# Altium schematic sheet Power_Supply_Current_Transformers.SchDoc
size A4; CompanyName: Technische Hochschule Nürnberg Georg Simon Ohm; Organization: UltraZohm; Address1: Kesslerplatz 12; Address2: 90489 Nürnberg; Address3: GERMANY; SheetNumber: 6; SheetTotal: 6; Website: www.ultrazohm.com
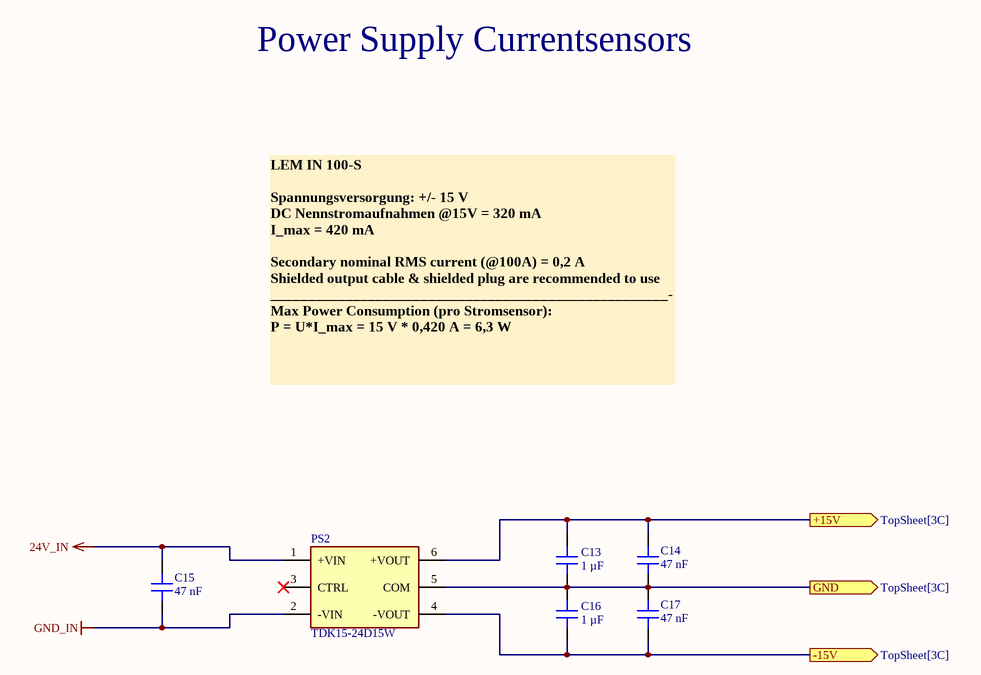
[diagram p0: Power_Supply_Current_Transformers.SchDoc]

## Parts
C13  1 µF  [C_0603]
C14  47 nF  [C_0603]
C15  47 nF  [C_0603]
C16  1 µF  [C_0603]
C17  47 nF  [C_0603]
PS2  TDK15-24D15W  [TDK15-24D15W]

## Ports
+15V (out, see TopSheet[3C]), -15V (out, see TopSheet[3C]), GND (out, see TopSheet[3C])

## Nets
24V_IN: C15.2 PS2.1(+VIN)
GND_IN: C15.1 PS2.2(-VIN)
+15V: C13.2 C14.2 PS2.6(+VOUT) ; port +15V
-15V: C16.1 C17.1 PS2.4(-VOUT) ; port -15V
GND: C13.1 C14.1 C16.2 C17.2 PS2.5(COM) ; port GND

Not connected (* = marked no-connect by the designer): PS2 3(CTRL)*

## Notes on the sheet
- Power Supply Currentsensors
- LEM IN 100-S
  Spannungsversorgung: +/- 15 V
  DC Nennstromaufnahmen @15V = 320 mA
  I_max = 420 mA
  Secondary nominal RMS current (@100A) = 0,2 A
  Shielded output cable & shielded plug are recommended to use
  _____________________________________________________-
  Max Power Consumption (pro Stromsensor):
  P = U*I_max = 15 V * 0,420 A = 6,3 W
- Title
- Revision:
- Design Engineer:
- Date:
- Project:
- Sheet
- of

## Library data of the parts
C13 C16 = CL10A105KB8NNNC: 50V 1uF X5R ±10% 0603  Multilayer Ceramic Capacitors MLCC - SMD/SMT ROHS; Manufacturer: Samsung Electro-Mechanics; Voltage Rating: 50 VDC; Created from: MGremer; Supplier 1: LCSC; Supplier Part Number 1: C15849; Manufacturer Part Number: CL10A105KB8NNNC; Value: 1 µF; PartID: 5; Created On: 20.12.2020 13:54:13; ComponentLink1Description: Datasheet; ComponentLink1URL: https://datasheet.lcsc.com/lcsc/1810261812_Samsung-Electro-Mechanics-CL10A105KB8NNNC_C15849.pdf; Component Type: Capacitor 0603; Device Package: 0603; Last Updated: 28.11.2022 17:23:01; Mounting Type: SMD; Operating Temperature: -55 - 85°C; Series: M; Type: Capacitor; Tolerance: 10 %; Live Cycle Status: 1; LCSC Part Number: C15849; Stock number: Labor SMD Container
C14 C15 C17 = CL10B473KB8NNNC: Capacitor 0603, 50 VDC, 47 nF, X7R; Manufacturer: Samsung Electro-Mechanics; Tolerance: 10 %; Voltage Rating: 50 VDC; Created from: DHufnagel; Manufacturer Part Number: CL10B473KB8NNNC; PartID: 97; Created On: 20/07/2022 09:55:05; ComponentLink1Description: Datasheet; ComponentLink1URL: https://www.mouser.de/datasheet/2/585/MLCC-1837944.pdf; Component Type: Capacitor 0603; Device Package: 0603; Last Updated: 20/07/2022 09:55:05; Mounting Type: SMD; Operating Temperature: -55 - 125°C; Series: X7R; Supplier 1: Mouser; Supplier Part Number 1: 187-CL10B473KB8NNNC; Supplier 2: LCSC; Supplier Part Number 2: C1622; Type: Capacitor; Value: 47 nF; Live Cycle Status: 1; LCSC Part Number: C1622; Stock number: not stored
PS2 = TDK15-24D15W: Isolated Module DC DC Converter Buck 2 Output ±15V 500mA 9V~36V Input; Manufacturer: TDPOWER; Created from: TGaupp; Manufacturer Part Number: TDK15-24D15W; PartID: 26; Created On: 20/05/2026 14:56:35; ComponentLink1Description: Datasheet; ComponentLink1URL: https://www.lcsc.com/datasheet/C783530.pdf?spm=wm.sxq.inf.ggs___wm.fly.bg.0.xh&lcsc_vid=RlUMVwJUE1RdV1AHElFcBVIFQlFcAQcFQlFaAgcCR1gxVlNRTlNWVFZeR1NeXzsOAxUeFF5JWBYZEEoKFBINSQcJGk4NBhADEA4cHktXRlhXSQwSGg0%3D; Component Type: DC-DC Converters; Device Package: 25.4 mm x 25.4 mm x 11mm; Last Updated: 20/05/2026 15:16:51; Mounting Type: THT; Operating Temperature: -40℃~+85℃; Supplier 1: LCSC; Supplier Part Number 1: C783530; Type: DC-DC Converters; Live Cycle Status: 1; LCSC Part Number: C783530; Stock number: not stored